# Altium schematic sheet dac-ic.SchDoc: DAC7562
size A4; DrawnBy: Dylan Vogel; Organization: UTAT SS; DocumentNumber: 4; Revision: 1; SheetNumber: 4; SheetTotal: 13
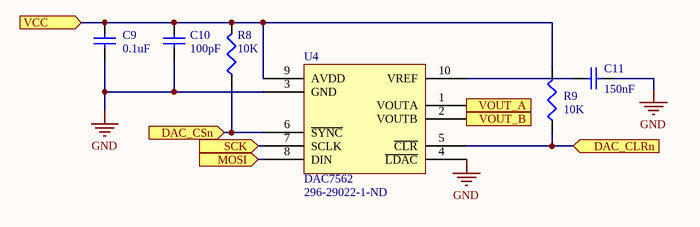
[diagram p0: dac-ic.SchDoc]

## Parts
C9  0.1uF  [0402]
C10  100pF  [0402]
C11  150nF  [0402]
R8  10K  [0402]
R9  10K  [0402]
U4  DAC7562  Supplier Part Number 1: 296-29022-1-ND  [SOP10-50P300X300-10N]

## Ports
DAC_CLRn (in), DAC_CSn (in), MOSI (in), SCK (in), VCC (in), VOUT_A (out), VOUT_B (out)

## Nets
GND: C9.1 C10.1 C11.2 U4.3(GND) U4.4(~{LDAC})
DAC_CLRn: R9.1 U4.5(~{CLR}) ; port DAC_CLRn
DAC_CSn: R8.1 U4.6(~{SYNC}) ; port DAC_CSn
MOSI: U4.8(DIN) ; port MOSI
SCK: U4.7(SCLK) ; port SCK
VCC: C9.2 C10.2 R8.2 R9.2 U4.9(AVDD) ; port VCC
VOUT_A: U4.1(VOUTA) ; port VOUT_A
VOUT_B: U4.2(VOUTB) ; port VOUT_B
NetC11_1: C11.1 U4.10(VREF)

## Library data of the parts
C9-C11 = Cap Semi: Capacitor (Semiconductor SIM Model); Published: 8-Jun-2000; LatestRevisionDate: 29-May-2009; LatestRevisionNote: IPC-7351 Footprint Added.; PackageReference: C1206; Publisher: Altium Limited; PackageDescription: Chip Capacitor; Supplier: Digi-Key; Supplier 1: Digi-Key
  C9: Value: 0.1uF; Supplier Part Number: 587-3807-1-ND
  C10: Value: 100pF; Supplier Part Number: 1276-1632-1-ND
  C11: Value: 150nF; Supplier Part Number: 1276-1972-1-ND
R8 R9 = Res3: Resistor; Published: 8-Jun-2000; LatestRevisionDate: 29-May-2009; LatestRevisionNote: IPC-7351 Footprint Added.; PackageReference: J1-0603; Publisher: Altium Limited; PackageDescription: Chip Resistor; Value: 10K; Supplier: Digi-Key; Supplier 1: Digi-Key
U4 = DAC7562: 12-bit, low-power, voltage-output DAC with internal reference.; Supplier 1: Digi-Key; Supplier: Digi-Key